# Altium schematic sheet HeightRuleRoom1.9mm.SchDoc
size A4
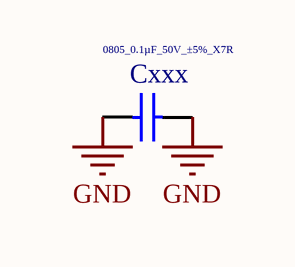
[diagram p0: HeightRuleRoom1.9mm.SchDoc]

## Parts
Cxxx  0805_0.1µF_50V_±5%_X7R  [0805C]

## Nets
GND: Cxxx.1 Cxxx.2

## Library data of the parts
Cxxx = 08055C104JAT2A: CAP CER 0.1UF 50V 5% X7R 0805; Manufacturer: AVX Corporation; Capacitance: 0.1µF; Document Name: HeightRuleRoom1.9mm.SchDoc; Part Number: 08055C104JAT2A; ParamsList: 0805_0.1µF_50V_±5%_X7R; Supplier 1: Digi-Key; Supplier Part Number 1: 478-3352-1-ND; Manufacturer Part Number: 08055C104JAT2A; RoHS: RoHS Compliant; Category: Capacitors; Stock 1: 277543; Pricing 1: 1=0.15, 10=0.1, 100=0.0475, 250=0.04, 500=0.0335, 1000=0.0275 (USD); Voltage - Rated: 50V; Tolerance: ±5%; Temperature Coefficient: X7R; Mounting Type: Surface Mount, MLCC; Operating Temperature: -55°C ~ 125°C; Applications: General Purpose; Ratings: -; Package / Case: 0805 (2012 Metric); Size / Dimension: 0.079" L x 0.049" W (2.01mm x 1.25mm); Height - Seated (Max): -; Thickness (Max): 0.055" (1.40mm); Lead Spacing: -; Features: -; Packaging: Cut Tape (CT); Lead Style: -; ComponentLink1URL: http://www.avx.com/docs/Catalogs/cx7r.pdf; ComponentLink1Description: http://www.avx.com/docs/Catalogs/cx7r.pdf; FootprintSizeX (mm): 3.5; FootprintSizeY (mm): 2; FootprintRectangleArea (mm): 7; Thickness (Max) (mm): 1.4; FootprintAlias: 0805